# EAGLE design Netzteil-Regler (EAGLE 6.2)
Linearer Spannungs- und Stomregler mit OP
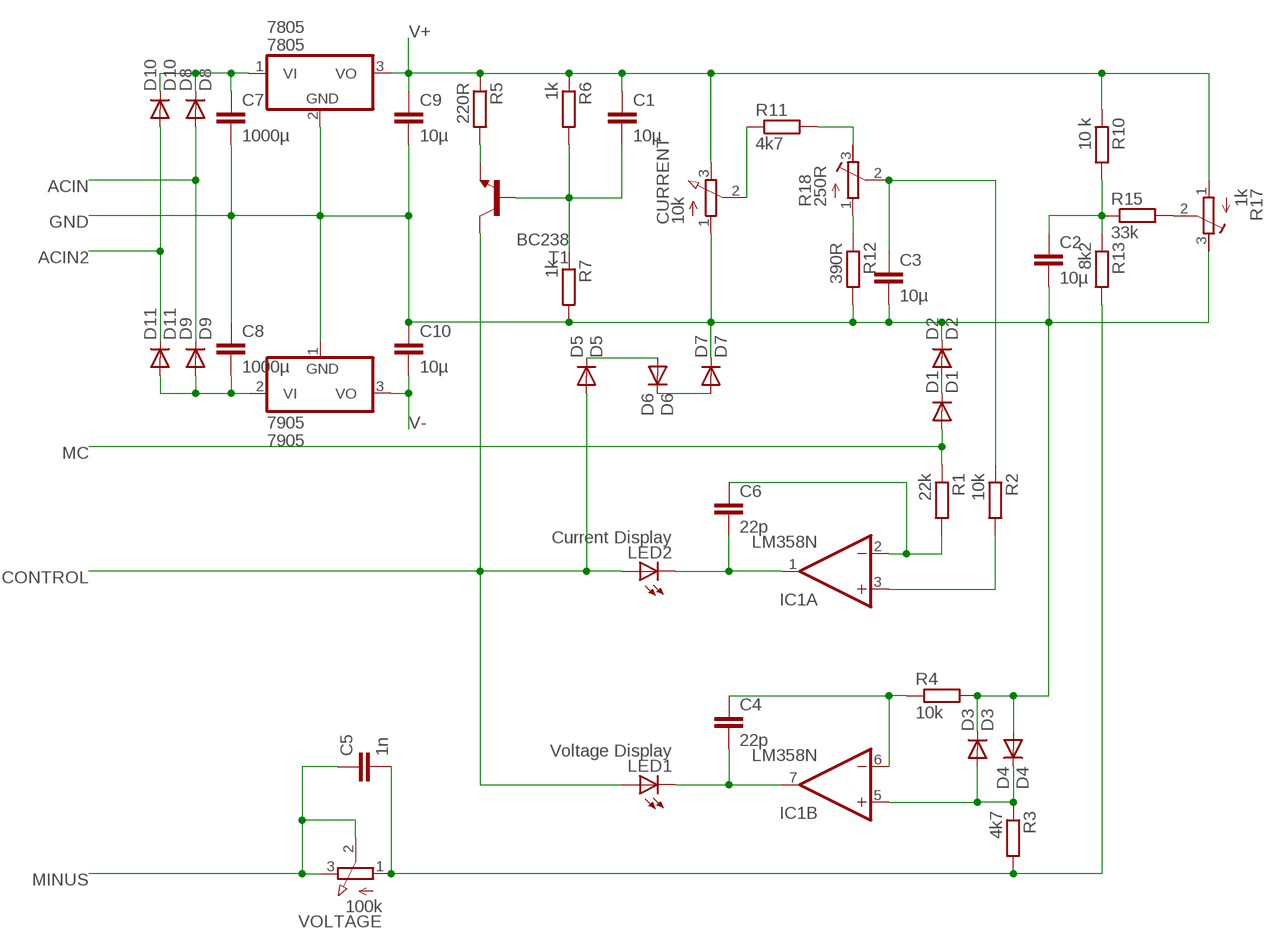
[diagram p0: schematic, sheet 1]

## Parts
7805  7805  7805TV  [TO220V]
7905  7905  MC79M05CT  [TO220V]
C1  10µ  C2.5/5  [C2.5-5]
C2  10µ  C2.5/5  [C2.5-5]
C3  10µ  C2.5/5  [C2.5-5]
C4  22p  C5/4.5  [C5B4.5]
C5  1n  C5/4.5  [C5B4.5]
C6  22p  C5/4.5  [C5B4.5]
C7  1000µ  C10/6  [C10B6]
C8  1000µ  C10/6  [C10B6]
C9  10µ  C2.5/5  [C2.5-5]
C10  10µ  C2.5/5  [C2.5-5]
CURRENT  10k  3RP/1610N  [3RP/1610N]
D1  D1  1N4148DO35-10  [DO35-10]
D2  D2  1N4148DO35-10  [DO35-10]
D3  D3  1N4148DO35-10  [DO35-10]
D4  D4  1N4148DO35-10  [DO35-10]
D5  D5  1N4148DO35-10  [DO35-10]
D6  D6  1N4148DO35-10  [DO35-10]
D7  D7  1N4148DO35-10  [DO35-10]
D8  D8  1N4004  [DO41-10]
D9  D9  1N4004  [DO41-10]
D10  D10  1N4004  [DO41-10]
D11  D11  1N4004  [DO41-10]
IC1  LM358N  [DIL08]
LED1  Voltage Display  LED5MM  [LED5MM]
LED2  Current Display  LED5MM  [LED5MM]
R1  22k  R-EU_0207/10  [0207/10]
R2  10k  R-EU_0207/10  [0207/10]
R3  4k7  R-EU_0207/10  [0207/10]
R4  10k  R-EU_0207/10  [0207/10]
R5  220R  R-EU_0207/10  [0207/10]
R6  1k  R-EU_0207/10  [0207/10]
R7  1k  R-EU_0207/10  [0207/10]
R10  10 k  R-EU_0207/10  [0207/10]
R11  4k7  R-EU_0207/10  [0207/10]
R12  390R  R-EU_0207/10  [0207/10]
R13  8k2  R-EU_0207/10  [0207/10]
R15  33k  R-EU_0207/10  [0207/10]
R17  1k  R-TRIMM3296W  [RTRIM3296W]
R18  250R  R-TRIMM3296W  [RTRIM3296W]
T1  BC238  BC238-NPN-TO92-CBE  [TO92-CBE]
VOLTAGE  100k  3RP/1610N  [3RP/1610N]

## Nets
ACIN: D8.A D9.C
ACIN2: D10.A D11.C
B: C1.2 R6.2 R7.1 T1.B
CONTROL: D5.A LED1.A LED2.A T1.C
E: R5.2 T1.E
GND: 7805.2(GND) 7905.1(GND) C2.2 C3.2 C7.2 C8.1 C9.2 C10.1 CURRENT.1(A) D2.C D3.C D4.A D7.C R4.2 R7.2 R12.2 R17.3(A)
MC: D1.A R1.1
MINUS: C5.1 VOLTAGE.2(S) VOLTAGE.3(E)
N$4: R11.2 R18.3(A)
N$5: C3.1 R2.1 R18.2(S)
N$6: R12.1 R18.1(E)
N$7: D1.C D2.A
N$8: C2.1 R10.2 R13.1 R15.1
N$9: CURRENT.2(S) R11.1
N$10: R15.2 R17.2(S)
N$11: IC1.3(A:+IN) R2.2
N$12: C6.1 IC1.2(A:-IN) R1.2
N$15: 7805.1(VI) C7.1 D8.C D10.C
N$17: D5.C D6.A
N$18: D6.C D7.A
N$19: C4.2 IC1.7(B:OUT) LED1.K(C)
N$20: C4.1 IC1.6(B:-IN) R4.1
N$22: D3.A D4.C IC1.5(B:+IN) R3.1
N$24: C5.2 R3.2 R13.2 VOLTAGE.1(A)
N$26: C6.2 IC1.1(A:OUT) LED2.K(C)
N$28: 7905.2(VI) C8.2 D9.A D11.A
V+: 7805.3(VO) C1.1 C9.1 CURRENT.3(E) R5.1 R6.1 R10.1 R17.1(E)
V-: 7905.3(VO) C10.2

## Power pins joined to a net without a drawn wire
V+: IC1.8(P:V+)
V-: IC1.4(P:V-)

## Library data of the parts
7805 = linear:78*: Positive VOLTAGE REGULATOR Source: http://cache.national.com/ds/LM/LM78L05.pdf http://www.fairchildsemi.com/ds/LM/LM7805.pdf
7905 = linear:MC79M: 500 mA Negative Voltage Regulators Source: Data sheet <http://www.onsemi.com/pub_link/Collateral/MC79M00-D.PDF>
C1-C10 = capacitor-wima:C: CAPACITOR naming: grid - package width
CURRENT VOLTAGE = pot:3RP/1610N: 16mm Potentiometer one level Source: http://www.alphapotentiometers.net/html/16mm_pot_2.html
D1-D7 = diode:1N4148: DIODE high speed (Philips)
D8-D11 = diode:1N4004: DIODE general purpose rectifier, 1 A
IC1 = linear:LM358: OP AMP also LM158; LM258; LM2904 Source: http://cache.national.com/ds/LM/LM158.pdf
LED1 LED2 = led:LED: LED OSRAM: - CHIPLED LG R971, LG N971, LY N971, LG Q971, LY Q971, LO R971, LY R971 LH N974, LH R974 LS Q976, LO Q976, LY Q976 LO Q996 - Hyper CHIPLED LW Q18S LB Q993, LB Q99A, LB R99A - SideLED LS A670, LO A670, LY A670, LG A670, LP A670 LB A673, LV A673, LT A673, LW A673 LH A674 LY A675 LS A676, LA A676, LO A676, LY A676, LW A676 LS A679, LY A679, LG A679 - Hyper Micro SIDELED® LS Y876, LA Y876, LO Y876, LY Y876 LT Y87S - SmartLED LW L88C, LW L88S LB L89C, LB L89S, LG L890 LS L89K, LO L89K, LY L89K LS L896, LA L896, LO L896, LY L896 - TOPLED LS T670, LO T670, LY T670, LG T670, LP T670 LSG T670, LSP T670, LSY T670, LOP T670, LYG T670 LG T671, LOG T671, LSG T671 LB T673, LV T673, LT T673, LW T673 LH T674 LS T676, LA T676, LO T676, LY T676, LB T676, LH T676, LSB T676, LW T676 LB T67C, LV T67C, LT T67C, LS T67K, LO T67K, LY T67K, LW E67C LS E67B, LA E67B, LO E67B, LY E67B, LB E67C, LV E67C, LT E67C LW T67C LS T679, LY T679, LG T679 LS T770, LO T770, LY T770, LG T770, LP T770 LB T773, LV T773, LT T773, LW T773 LH T774 LS E675, LA E675, LY E675, LS T675 LS T776, LA T776, LO T776, LY T776, LB T776 LHGB T686 LT T68C, LB T68C - Hyper Mini TOPLED® LB M676 - Mini TOPLED Santana® LG M470 LS M47K, LO M47K, LY M47K Source: http://www.osram.convergy.de LUXEON: - LUMILED® LXK2-PW12-R00, LXK2-PW12-S00, LXK2-PW14-U00, LXK2-PW14-V00 LXK2-PM12-R00, LXK2-PM12-S00, LXK2-PM14-U00 LXK2-PE12-Q00, LXK2-PE12-R00, LXK2-PE12-S00, LXK2-PE14-T00, LXK2-PE14-U00 LXK2-PB12-K00, LXK2-PB12-L00, LXK2-PB12-M00, LXK2-PB14-N00, LXK2-PB14-P00, LXK2-PB14-Q00 LXK2-PR12-L00, LXK2-PR12-M00, LXK2-PR14-Q00, LXK2-PR14-R00 LXK2-PD12-Q00, LXK2-PD12-R00, LXK2-PD12-S00 LXK2-PH12-R00, LXK2-PH12-S00 LXK2-PL12-P00, LXK2-PL12-Q00, LXK2-PL12-R00 Source: www.luxeon.com KINGBRIGHT: KA-3528ASYC Source: www.kingbright.com
R1-R7 R10-R13 R15 = resistor:R-EU_: RESISTOR, European symbol
R17 R18 = resistor:R-TRIMM: Trimm resistor
T1 = transistor:*-NPN-: NPN Transistror BF959 corrected 2008.03.06

## Board
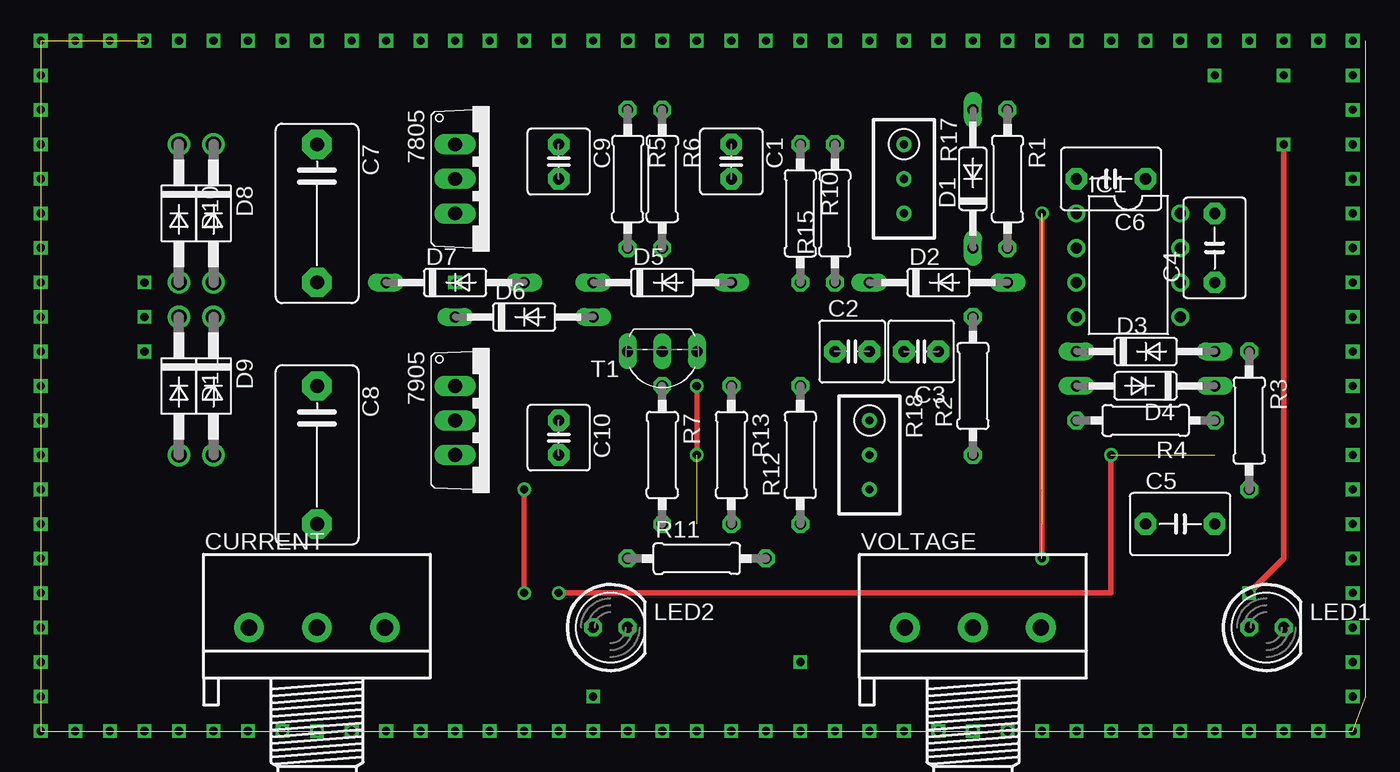
[diagram p1: board, top side]
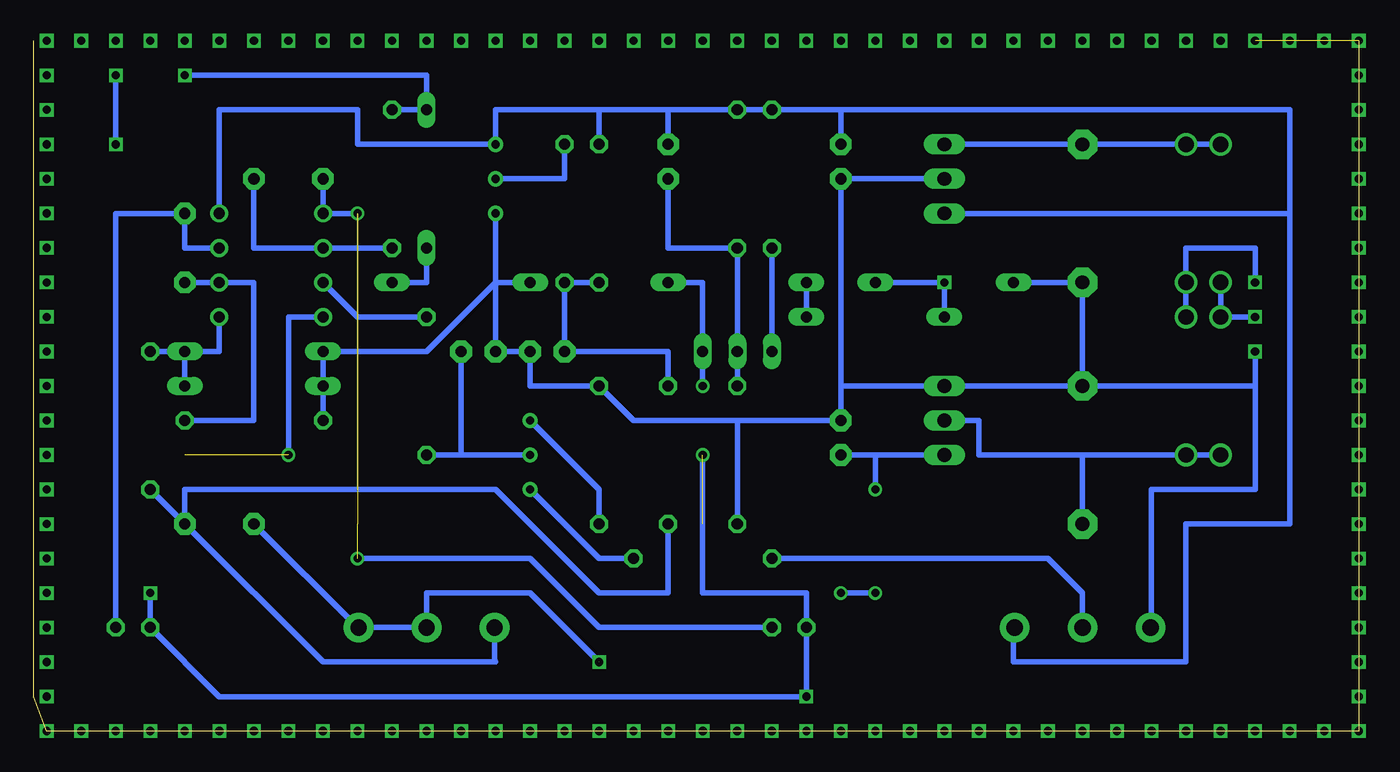
[diagram p2: board, bottom side, seen from below]

Size 97.46 x 50.8 mm. Coordinates in mm from the lower left corner, seen from the top.
Outline: 97.46,50.79 97.46,2.54 96.52,0 0,0 0,50.8
Copper layers (1*16): Top 0.035mm / dielectric 1.5mm / Bottom 0.035mm
Design rules: minimum track width 10mil, minimum drill 24mil, track to track 8mil, track to pad 8mil, pad to pad 8mil, via to via 8mil, smd to smd 8mil, copper to edge 40mil, drill to drill 8mil, minimum pad ring 10mil, minimum via ring 8mil, stop-mask expansion 4mil, vias tented up to drill 0mil, thermal gap 10mil

### Footprints (pad centres in the part's own frame; a part is rotated, then mirrored left to right if it is on the bottom)
TO220V = drill 1.016 long: 1 -2.54,-2.54; 2 0,-2.54; 3 2.54,-2.54
C2.5-5 = drill 0.813 pad 1.6 octagon: 1 -1.27,0; 2 1.27,0
C5B4.5 = drill 0.813 pad 1.6 octagon: 1 -2.54,0; 2 2.54,0
C10B6 = drill 1.016 pad 2.159 octagon: 1 -5.08,0; 2 5.08,0
3RP/1610N = drill 1.2 pad 2.184: 1 -5,0; 2 0,0; 3 5,0
DO35-10 = drill 0.813 long: A 5.08,0; C -5.08,0
DO41-10 = drill 1.118: A 5.08,0; C -5.08,0
DIL08 = drill 0.813 pad 1.27: 1 -3.81,-3.81; 2 -1.27,-3.81; 3 1.27,-3.81; 4 3.81,-3.81; 5 3.81,3.81; 6 1.27,3.81; 7 -1.27,3.81; 8 -3.81,3.81
LED5MM = drill 0.813 octagon: A -1.27,0; K 1.27,0
0207/10 = drill 0.813 octagon: 1 -5.08,0; 2 5.08,0
RTRIM3296W = drill 0.61: 1 0,-2.54; 2 0,0; 3 0,2.54
TO92-CBE = drill 0.813 long: B 0,0; C -2.54,0; E 2.54,0

### Placement (x,y rotation side)
7805  33.02,40.64 270 top
7905  33.02,22.86 270 top
C1  50.8,41.91 270 top
C2  59.69,27.94 0 top
C3  64.77,27.94 180 top
C4  86.36,35.56 90 top
C5  83.82,15.24 0 top
C6  78.74,40.64 180 top
C7  20.32,38.1 270 top
C8  20.32,20.32 270 top
C9  38.1,41.91 270 top
C10  38.1,21.59 270 top
CURRENT  20.32,7.62 0 top
D1  68.58,40.64 90 top
D2  66.04,33.02 0 top
D3  81.28,27.94 0 top
D4  81.28,25.4 180 top
D5  45.72,33.02 0 top
D6  35.56,30.48 0 top
D7  30.48,33.02 0 top
D8  12.7,38.1 270 top
D9  12.7,25.4 270 top
D10  10.16,38.1 270 top
D11  10.16,25.4 270 top
IC1  80.01,34.29 270 top
LED1  90.17,7.62 0 top
LED2  41.91,7.62 0 top
R1  71.12,40.64 270 top
R2  68.58,25.4 90 top
R3  88.9,22.86 270 top
R4  81.28,22.86 180 top
R5  43.18,40.64 270 top
R6  45.72,40.64 270 top
R7  45.72,20.32 270 top
R10  55.88,38.1 270 top
R11  48.26,12.7 0 top
R12  55.88,20.32 90 top
R13  50.8,20.32 270 top
R15  58.42,38.1 90 top
R17  63.5,40.64 180 top
R18  60.96,20.32 180 top
T1  45.72,27.94 180 top
VOLTAGE  68.58,7.62 0 top

### Tracks (layer width: path | path; a pad name or v marks a point on that pad's centre or on a via)
ACIN  (via drill 0.6)
  Bottom 0.406: D9.C D8.A 12.7,35.56 7.62,35.56 v7.62,33.02
ACIN2
  Bottom 0.406: D10.A D11.C 7.62,30.48
B
  Bottom 0.406: C1.2 50.8,35.56 R6.2 T1.B R7.1
CONTROL  (via drill 0.6)  (2 unrouted)
  Top 0.406: v48.26,25.4 48.26,20.32 | v88.9,10.16 91.44,12.7 v91.44,43.18
  Bottom 0.406: 48.26,20.32 48.26,10.16 40.64,10.16 LED2.A v40.64,2.54 83.82,2.54 LED1.A v88.9,10.16 | v48.26,25.4 T1.C 48.26,33.02 D5.A | v91.44,43.18 v91.44,48.26
E
  Bottom 0.406: T1.E R5.2
GND  (via drill 0.6)
  Bottom 0.406: C8.1 C7.2 D7.C | C8.1 7905.1 38.1,25.4 C10.1 | 7805.2 C9.2 C10.1 | C10.1 45.72,22.86 | 45.72,22.86 R7.2 | C8.1 7.62,25.4 v7.62,27.94 7.62,17.78 15.24,17.78 15.24,7.7 CURRENT.1 | 45.72,22.86 53.34,22.86 R12.2 60.96,25.4 C2.2 C3.2 63.5,33.02 | 63.5,33.02 D2.C | 63.5,33.02 R17.3 | R4.2 D4.A D3.C 68.58,27.94 63.5,33.02
MC  (via drill 0.6)
  Bottom 0.406: R1.1 D1.A 68.58,48.26 v86.36,48.26
MINUS  (via drill 0.6)  (1 unrouted)
  Bottom 0.406: C5.1 73.74,7.7 73.66,7.7 VOLTAGE.3 VOLTAGE.2 68.58,10.16 60.96,10.16 v55.88,5.08
  other vias: 10.16,0
N$4
  Bottom 0.406: R11.2 55.88,12.7 R18.3
N$5
  Bottom 0.406: R18.2 66.04,20.32 | 66.04,20.32 C3.1 | 66.04,20.32 R2.1
N$6
  Bottom 0.406: R12.1 55.88,17.78 R18.1
N$7
  Bottom 0.406: D2.A 68.58,33.02 D1.C
N$8
  Bottom 0.406: R10.2 R15.1 C2.1 50.8,27.94 R13.1
N$9
  Bottom 0.406: R11.1 22.86,12.7 20.32,10.16 CURRENT.2
N$10
  Bottom 0.406: R15.2 58.42,40.64 R17.2
N$11
  Bottom 0.406: R2.2 73.66,30.48 IC1.3
N$12
  Bottom 0.406: C6.1 81.28,35.56 IC1.2 R1.2
N$13  (via drill 0.6)
  other vias: 0,2.54
N$14  (via drill 0.6)
  other vias: 48.26,20.32
N$15
  Bottom 0.406: 7805.1 C7.1 D8.C D10.C
N$16  (via drill 0.6)
  other vias: 76.2,38.1
N$17
  Bottom 0.406: D6.A D5.C
N$18  (via drill 0.6)
  Bottom 0.406: D7.A v30.48,33.02 D6.C
N$19
  Bottom 0.406: IC1.7 86.36,35.56 C4.2 91.44,38.1 LED1.K
N$20
  Bottom 0.406: IC1.6 C4.1 81.28,33.02 81.28,22.86 R4.1
N$22
  Bottom 0.406: D4.C D3.A | D3.A 83.82,27.94 IC1.5 | R3.1 D3.A
N$23  (via drill 0.6)
  other vias: 0,5.08
N$24
  Bottom 0.406: R13.2 50.8,10.16 55.88,10.16 63.5,17.78 86.36,17.78 C5.2 | C5.2 R3.2 | VOLTAGE.1 63.58,5.16 63.5,5.08 76.2,5.08 C5.2
N$25  (via drill 0.6)
  other vias: 0,7.62
N$26  (via drill 0.6)  (5 unrouted)
  Top 0.406: v73.66,12.7 v73.66,38.1
  Bottom 0.406: C6.2 IC1.1 v73.66,38.1 | LED2.K 55.88,7.62 60.96,12.7 v73.66,12.7
N$27  (via drill 0.6)
  other vias: 0,10.16
N$28
  Bottom 0.406: 20.32,20.32 C8.2 | 20.32,20.32 27.94,20.32 27.94,22.86 7905.2 | 20.32,20.32 D9.A D11.A
N$29  (via drill 0.6)
  other vias: 0,12.7
N$30  (via drill 0.6)
  other vias: 0,15.24
N$31  (via drill 0.6)
  other vias: 0,17.78
N$32  (via drill 0.6)
  other vias: 0,22.86
N$33  (via drill 0.6)
  other vias: 0,20.32
N$34  (via drill 0.6)
  other vias: 0,25.4
N$35  (via drill 0.6)
  other vias: 0,27.94
N$36  (via drill 0.6)
  other vias: 0,30.48
N$37  (via drill 0.6)
  other vias: 0,33.02
N$38  (via drill 0.6)
  other vias: 0,35.56
N$39  (via drill 0.6)
  other vias: 0,38.1
N$40  (via drill 0.6)
  other vias: 0,40.64
N$41  (via drill 0.6)
  other vias: 0,43.18
N$42  (via drill 0.6)
  other vias: 0,45.72
N$43  (via drill 0.6)
  other vias: 0,48.26
N$44  (via drill 0.6)  (2 unrouted)
  other vias: 5.08,0 2.54,0 0,0
N$45  (via drill 0.6)
  other vias: 7.62,0
N$47  (via drill 0.6)
  other vias: 12.7,0
N$48  (via drill 0.6)
  other vias: 15.24,0
N$49  (via drill 0.6)
  other vias: 17.78,0
N$50  (via drill 0.6)
  other vias: 20.32,0
N$51  (via drill 0.6)
  other vias: 22.86,0
N$52  (via drill 0.6)
  other vias: 25.4,0
N$53  (via drill 0.6)
  other vias: 27.94,0
N$54  (via drill 0.6)
  other vias: 30.48,0
N$55  (via drill 0.6)
  other vias: 33.02,0
N$56  (via drill 0.6)
  other vias: 38.1,0
N$57  (via drill 0.6)
  other vias: 35.56,0
N$58  (via drill 0.6)
  other vias: 40.64,0
N$59  (via drill 0.6)
  other vias: 43.18,0
N$60  (via drill 0.6)
  other vias: 45.72,0
N$61  (via drill 0.6)
  other vias: 48.26,0
N$62  (via drill 0.6)
  other vias: 50.8,0
N$63  (via drill 0.6)
  other vias: 53.34,0
N$64  (via drill 0.6)
  other vias: 55.88,0
N$65  (via drill 0.6)
  other vias: 58.42,0
N$66  (via drill 0.6)
  other vias: 60.96,0
N$67  (via drill 0.6)
  other vias: 63.5,0
N$68  (via drill 0.6)
  other vias: 66.04,0
N$69  (via drill 0.6)
  other vias: 68.58,0
N$70  (via drill 0.6)
  other vias: 71.12,0
N$71  (via drill 0.6)
  other vias: 73.66,0
N$72  (via drill 0.6)
  other vias: 76.2,0
N$73  (via drill 0.6)
  other vias: 78.74,0
N$74  (via drill 0.6)
  other vias: 81.28,0
N$75  (via drill 0.6)
  other vias: 83.82,0
N$76  (via drill 0.6)
  other vias: 86.36,0
N$77  (via drill 0.6)
  other vias: 88.9,0
N$78  (via drill 0.6)
  other vias: 91.44,0
N$79  (via drill 0.6)
  other vias: 93.98,0
N$80  (via drill 0.6)
  other vias: 96.52,0
N$81  (via drill 0.6)
  other vias: 96.52,2.54
N$82  (via drill 0.6)
  other vias: 96.52,5.08
N$83  (via drill 0.6)
  other vias: 96.52,7.62
N$84  (via drill 0.6)
  other vias: 96.52,10.16
N$85  (via drill 0.6)
  other vias: 96.52,12.7
N$86  (via drill 0.6)
  other vias: 96.52,15.24
N$87  (via drill 0.6)
  other vias: 96.52,17.78
N$88  (via drill 0.6)
  other vias: 96.52,20.32
N$89  (via drill 0.6)
  other vias: 96.52,22.86
N$90  (via drill 0.6)
  other vias: 96.52,25.4
N$91  (via drill 0.6)
  other vias: 96.52,27.94
N$92  (via drill 0.6)
  other vias: 96.52,30.48
N$93  (via drill 0.6)
  other vias: 96.52,33.02
N$94  (via drill 0.6)
  other vias: 96.52,35.56
N$95  (via drill 0.6)
  other vias: 96.52,38.1
N$96  (via drill 0.6)
  other vias: 96.52,40.64
N$97  (via drill 0.6)
  other vias: 96.52,43.18
N$98  (via drill 0.6)
  other vias: 96.52,45.72
N$99  (via drill 0.6)
  other vias: 96.52,48.26
N$100  (via drill 0.6)
  other vias: 96.52,50.8
N$101  (via drill 0.6)
  other vias: 93.98,50.8
N$102  (via drill 0.6)
  other vias: 91.44,50.8
N$103  (via drill 0.6)
  other vias: 88.9,50.8
N$104  (via drill 0.6)
  other vias: 86.36,50.8
N$105  (via drill 0.6)
  other vias: 83.82,50.8
N$106  (via drill 0.6)
  other vias: 81.28,50.8
N$107  (via drill 0.6)
  other vias: 78.74,50.8
N$108  (via drill 0.6)
  other vias: 76.2,50.8
N$109  (via drill 0.6)
  other vias: 73.66,50.8
N$110  (via drill 0.6)
  other vias: 71.12,50.8
N$111  (via drill 0.6)
  other vias: 68.58,50.8
N$112  (via drill 0.6)
  other vias: 66.04,50.8
N$113  (via drill 0.6)
  other vias: 63.5,50.8
N$114  (via drill 0.6)
  other vias: 60.96,50.8
N$115  (via drill 0.6)
  other vias: 58.42,50.8
N$116  (via drill 0.6)
  other vias: 55.88,50.8
N$117  (via drill 0.6)
  other vias: 53.34,50.8
N$118  (via drill 0.6)
  other vias: 50.8,50.8
N$119  (via drill 0.6)
  other vias: 48.26,50.8
N$120  (via drill 0.6)
  other vias: 45.72,50.8
N$121  (via drill 0.6)
  other vias: 43.18,50.8
N$122  (via drill 0.6)
  other vias: 40.64,50.8
N$123  (via drill 0.6)
  other vias: 38.1,50.8
N$124  (via drill 0.6)
  other vias: 35.56,50.8
N$125  (via drill 0.6)
  other vias: 33.02,50.8
N$126  (via drill 0.6)
  other vias: 30.48,50.8
N$127  (via drill 0.6)
  other vias: 27.94,50.8
N$128  (via drill 0.6)
  other vias: 25.4,50.8
N$129  (via drill 0.6)
  other vias: 22.86,50.8
N$130  (via drill 0.6)
  other vias: 20.32,50.8
N$131  (via drill 0.6)
  other vias: 17.78,50.8
N$132  (via drill 0.6)
  other vias: 15.24,50.8
N$133  (via drill 0.6)
  other vias: 12.7,50.8
N$134  (via drill 0.6)
  other vias: 10.16,50.8
N$135  (via drill 0.6)  (3 unrouted)
  other vias: 7.62,50.8 5.08,50.8 2.54,50.8 0,50.8
N$136  (via drill 0.6)
  other vias: 7.62,30.48 7.62,30.48
V+
  Bottom 0.406: 5.08,38.1 5.08,45.72 38.1,45.72 | 38.1,45.72 C9.1 | 38.1,45.72 R5.1 R6.1 50.8,45.72 | 50.8,45.72 C1.1 | 5.08,38.1 7805.3 | CURRENT.3 25.4,7.62 25.4,5.08 12.7,5.08 12.7,15.24 5.08,15.24 5.08,38.1 | IC1.8 83.82,45.72 73.66,45.72 73.66,43.18 R17.1 63.5,45.72 55.88,45.72 | 50.8,45.72 55.88,45.72 | R10.1 55.88,45.72
V-  (via drill 0.6)  (1 unrouted)
  Top 0.406: v35.56,10.16 v35.56,17.78 | v38.1,10.16 78.74,10.16 v78.74,20.32
  Bottom 0.406: 35.56,20.32 7905.3 | 35.56,20.32 C10.2 | v35.56,17.78 35.56,20.32 | v35.56,10.16 v38.1,10.16 | IC1.4 78.74,30.48 v78.74,20.32

### Text on the board
Pads: MC | Control | ~ | GND | Minus
Vias: ~
tValues: A
bValues: A | - | + | - | + | Current Control | Voltage Control